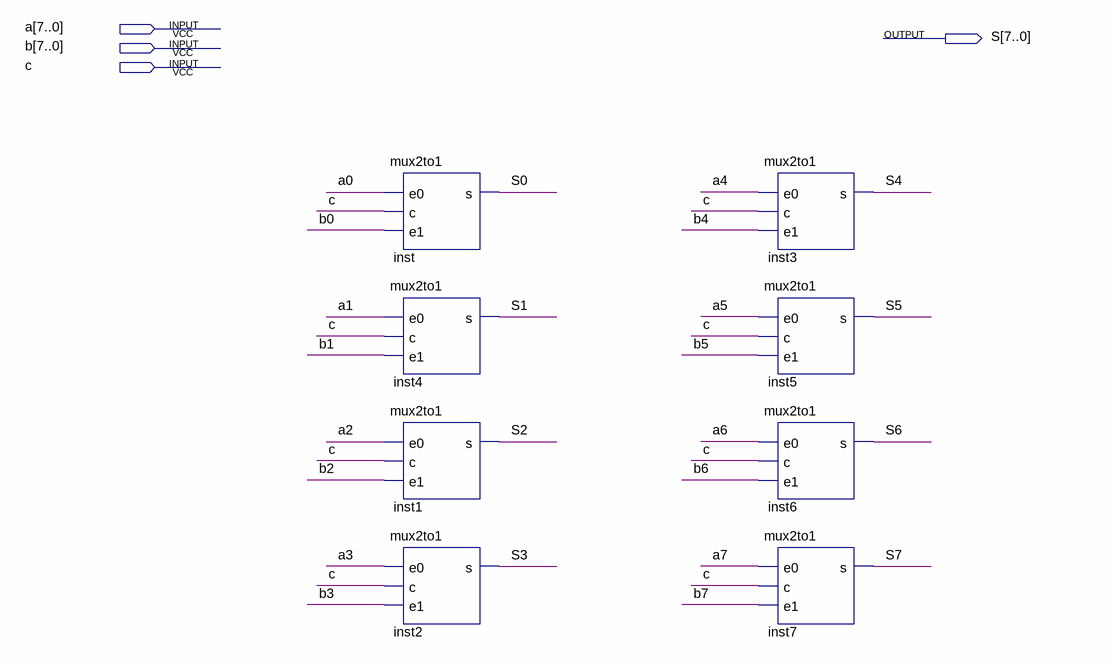
[diagram p0: schematic sheet]
// Quartus schematic mux2x1_8bits.bdf as structural Verilog: 8 symbols, 4 pins
module mux2x1_8bits (
  input  [7:0] a,
  input  [7:0] b,
  input  c,
  output [7:0] S
);

  mux2to1 inst (.e0(a[0]), .c(c), .e1(b[0]), .s(S[0]));
  mux2to1 inst4 (.e0(a[1]), .c(c), .e1(b[1]), .s(S[1]));
  mux2to1 inst1 (.e0(a[2]), .c(c), .e1(b[2]), .s(S[2]));
  mux2to1 inst2 (.e0(a[3]), .c(c), .e1(b[3]), .s(S[3]));
  mux2to1 inst3 (.e0(a[4]), .c(c), .e1(b[4]), .s(S[4]));
  mux2to1 inst5 (.e0(a[5]), .c(c), .e1(b[5]), .s(S[5]));
  mux2to1 inst6 (.e0(a[6]), .c(c), .e1(b[6]), .s(S[6]));
  mux2to1 inst7 (.e0(a[7]), .c(c), .e1(b[7]), .s(S[7]));
endmodule
